# Altium schematic sheet HLK-AX3000-KIT-RJ45.SchDoc
size A3
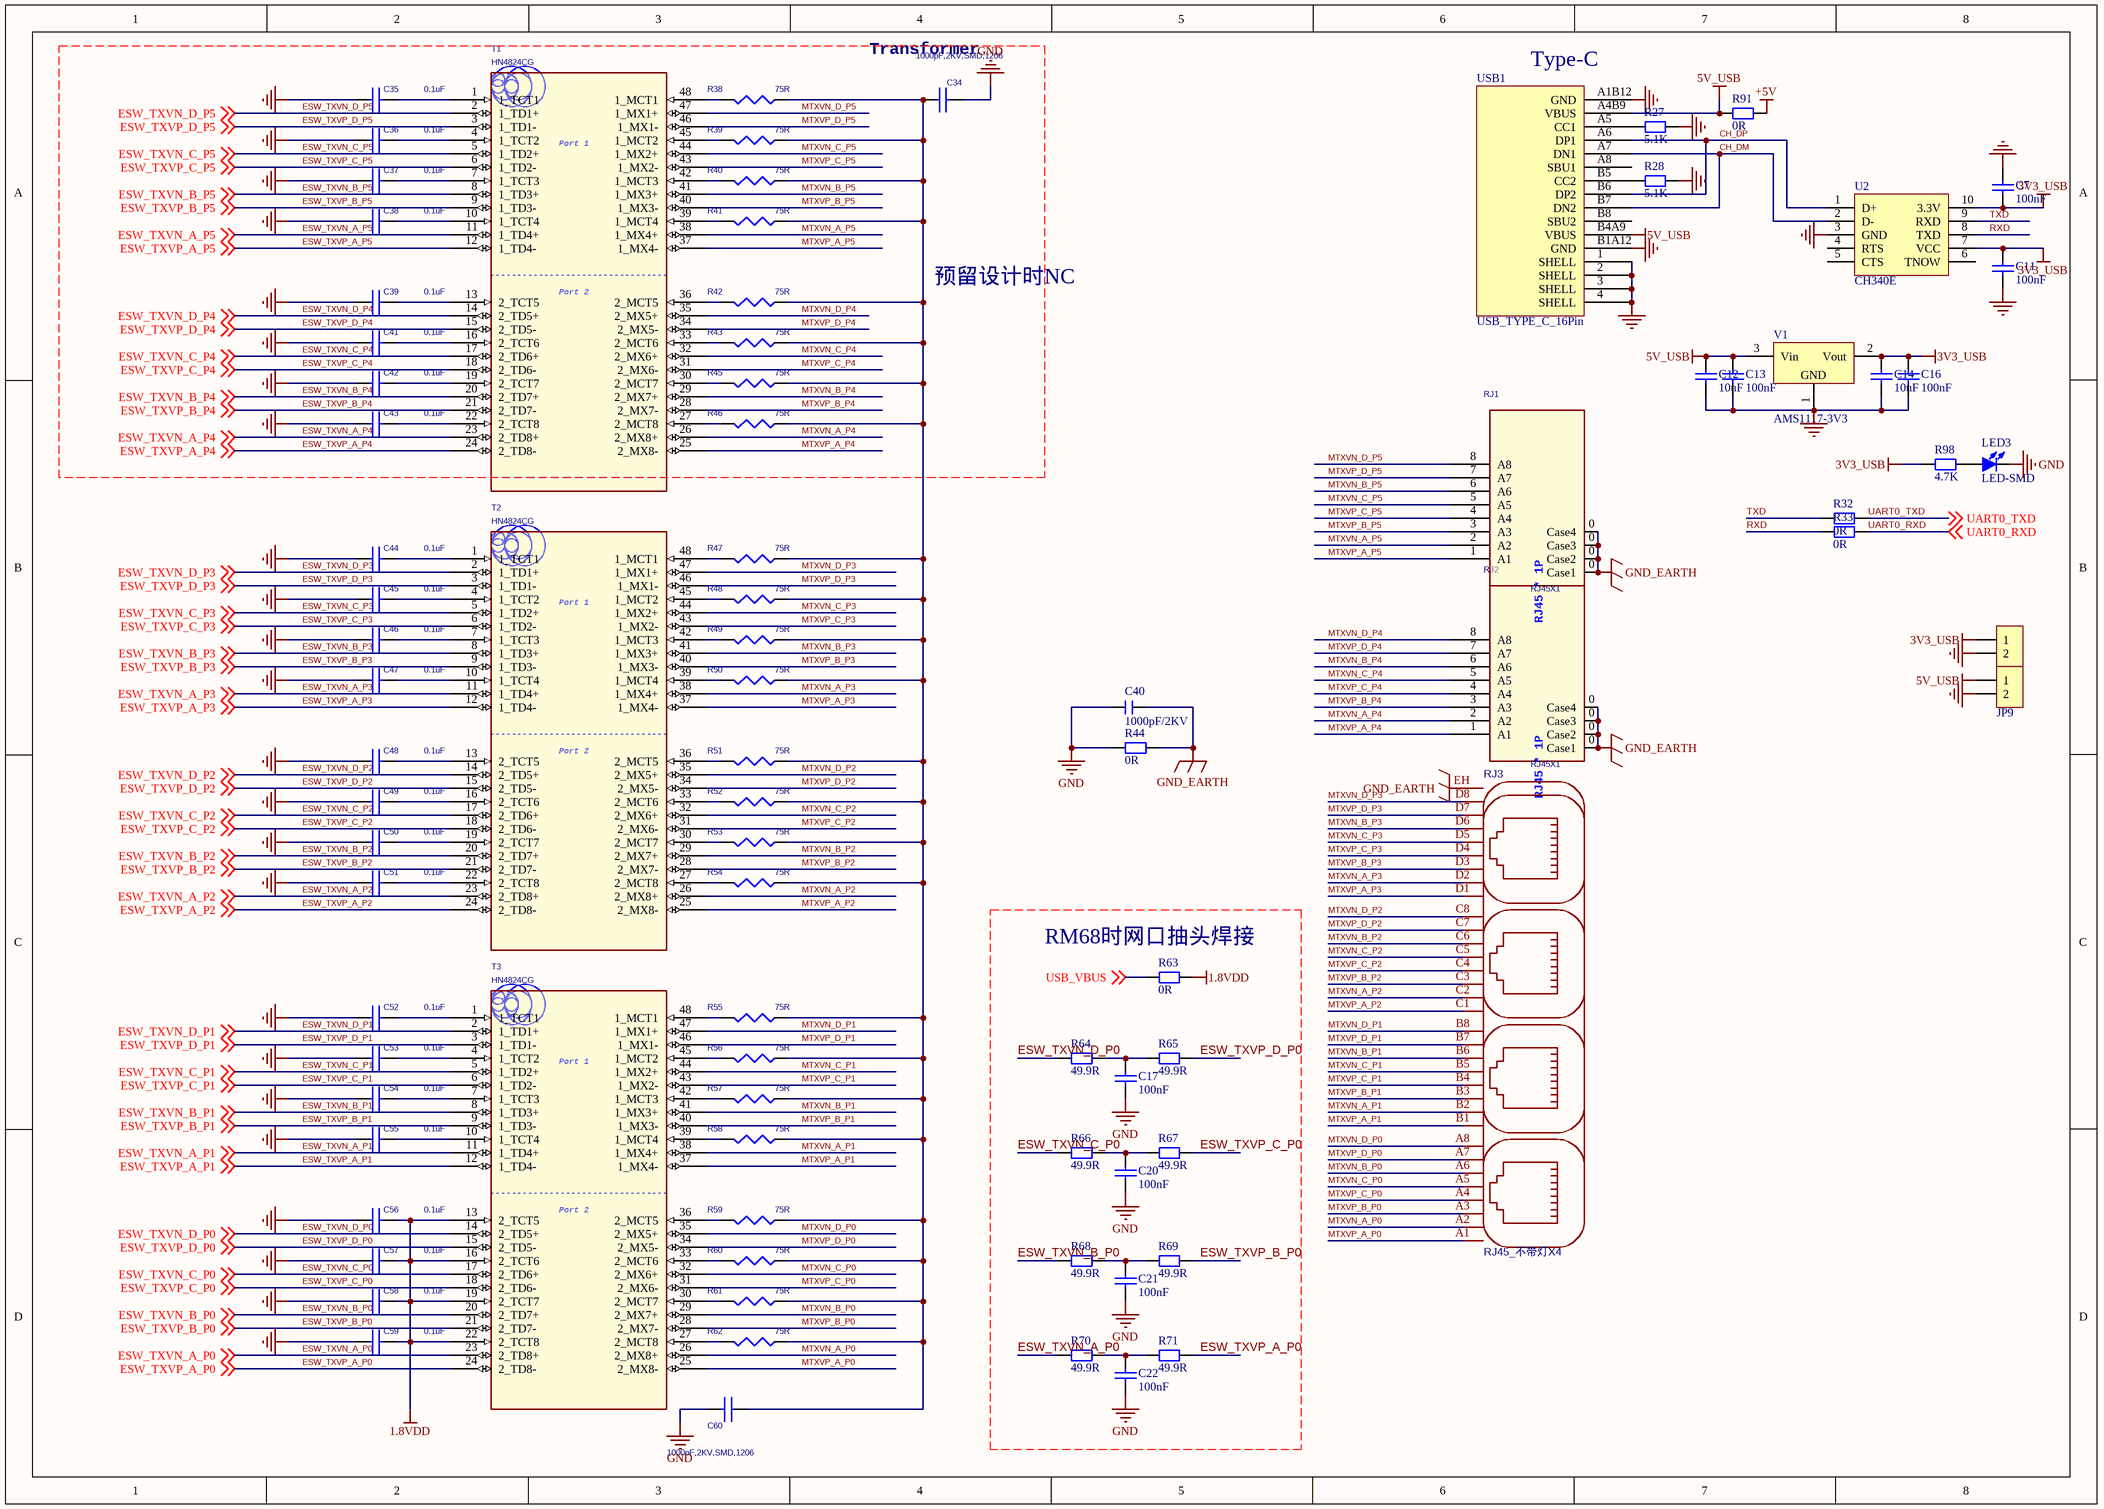
[diagram p0: HLK-AX3000-KIT-RJ45.SchDoc]

## Parts
C7  100nF  [C 0402_L]
C11  100nF  [C 0402_L]
C12  10uF  [C 0603_L]
C13  100nF  [C 0402_L]
C14  10uF  [C 0603_L]
C16  100nF  [C 0402_L]
C17  100nF  [C 0402_L]
C20  100nF  [C 0402_L]
C21  100nF  [C 0402_L]
C22  100nF  [C 0402_L]
C34  1000pF,2KV,SMD,1206  [C 1206_L]
C35  0.1uF  [C 0402_L]
C36  0.1uF  [C 0402_L]
C37  0.1uF  [C 0402_L]
C38  0.1uF  [C 0402_L]
C39  0.1uF  [C 0402_L]
C40  1000pF/2KV  [C 1206_L]
C41  0.1uF  [C 0402_L]
C42  0.1uF  [C 0402_L]
C43  0.1uF  [C 0402_L]
C44  0.1uF  [C 0402_L]
C45  0.1uF  [C 0402_L]
C46  0.1uF  [C 0402_L]
C47  0.1uF  [C 0402_L]
C48  0.1uF  [C 0402_L]
C49  0.1uF  [C 0402_L]
C50  0.1uF  [C 0402_L]
C51  0.1uF  [C 0402_L]
C52  0.1uF  [C 0402_L]
C53  0.1uF  [C 0402_L]
C54  0.1uF  [C 0402_L]
C55  0.1uF  [C 0402_L]
C56  0.1uF  [C 0402_L]
C57  0.1uF  [C 0402_L]
C58  0.1uF  [C 0402_L]
C59  0.1uF  [C 0402_L]
C60  1000pF,2KV,SMD,1206  [C 1206_L]
JP8  HDR-1X2  [HDR2.54-LI-2P]  (value not drawn)
JP9  HDR-1X2  [HDR2.54-LI-2P]  (value not drawn)
LED3  LED-SMD  [LED 0603G-L]
R27  5.1K  [R 0402_L]
R28  5.1K  [R 0402_L]
R32  0R  [R 0402_L]
R33  0R  [R 0402_L]
R38  75R  [R 0402_L]
R39  75R  [R 0402_L]
R40  75R  [R 0402_L]
R41  75R  [R 0402_L]
R42  75R  [R 0402_L]
R43  75R  [R 0402_L]
R44  0R  [R 1206_L]
R45  75R  [R 0402_L]
R46  75R  [R 0402_L]
R47  75R  [R 0402_L]
R48  75R  [R 0402_L]
R49  75R  [R 0402_L]
R50  75R  [R 0402_L]
R51  75R  [R 0402_L]
R52  75R  [R 0402_L]
R53  75R  [R 0402_L]
R54  75R  [R 0402_L]
R55  75R  [R 0402_L]
R56  75R  [R 0402_L]
R57  75R  [R 0402_L]
R58  75R  [R 0402_L]
R59  75R  [R 0402_L]
R60  75R  [R 0402_L]
R61  75R  [R 0402_L]
R62  75R  [R 0402_L]
R63  0R  [R 0402_L]
R64  49.9R  [R 0402_L]
R65  49.9R  [R 0402_L]
R66  49.9R  [R 0402_L]
R67  49.9R  [R 0402_L]
R68  49.9R  [R 0402_L]
R69  49.9R  [R 0402_L]
R70  49.9R  [R 0402_L]
R71  49.9R  [R 0402_L]
R91  0R  [R 0603_L]
R98  4.7K  [R 0402_L]
RJ1  RJ45X1  [RJ45_网口不带灯X1]
RJ2  RJ45X1  [RJ45_网口不带灯X1]
RJ3  RJ45_不带灯X4  [RJ45_网口不带灯X4]
T1  HN4824CG  [TRANSFORMER/48P/SMD/GS5014LF]
T2  HN4824CG  [TRANSFORMER/48P/SMD/GS5014LF]
T3  HN4824CG  [TRANSFORMER/48P/SMD/GS5014LF]
U2  CH340E  [MSOP10_L]
USB1  USB_TYPE_C_16Pin  [USB-C-16PIN-1]
V1  AMS1117-3V3  [SOT223_L]

## Nets
1.8VDD: C56.2 C57.2 C58.2 C59.2 R63.1 T3.13(2_TCT5) T3.16(2_TCT6) T3.19(2_TCT7) T3.22(2_TCT8)
3V3_USB: C7.2 C11.2 C14.2 C16.1 JP8.1 R98.2 U2.7(VCC) U2.10(3.3V) V1.2(Vout)
5V_USB: C12.2 C13.1 JP9.1 R91.1 USB1.A4B9(VBUS) USB1.B4A9(VBUS) V1.3(Vin)
+5V: R91.2
GND: C7.1 C11.1 C12.1 C13.2 C14.1 C16.2 C17.2 C20.2 C21.2 C22.2 C34.2 C35.1 C36.1 C37.1 C38.1 C39.1 C40.1 C41.1 C42.1 C43.1 C44.1 C45.1 C46.1 C47.1 C48.1 C49.1 C50.1 C51.1 C52.1 C53.1 C54.1 C55.1 C56.1 C57.1 C58.1 C59.1 C60.2 JP8.2 JP9.2 LED3.2(K) R27.1 R28.1 R44.1 U2.3(GND) USB1.1(SHELL) USB1.2(SHELL) USB1.3(SHELL) USB1.4(SHELL) USB1.A1B12(GND) USB1.B1A12(GND) V1.1(GND)
GND_EARTH: C40.2 R44.2 RJ1.0(Case1) RJ2.0(Case1) RJ3.EH
CH_DM: U2.2(D-) USB1.A7(DN1) USB1.B7(DN2)
CH_DP: U2.1(D+) USB1.A6(DP1) USB1.B6(DP2)
ESW_TXVN_A_P0: R70.1 T3.23(2_TD8+) ; off-sheet ESW_TXVN_A_P0
ESW_TXVN_A_P1: T3.11(1_TD4+) ; off-sheet ESW_TXVN_A_P1
ESW_TXVN_A_P2: T2.23(2_TD8+) ; off-sheet ESW_TXVN_A_P2
ESW_TXVN_A_P3: T2.11(1_TD4+) ; off-sheet ESW_TXVN_A_P3
ESW_TXVN_A_P4: T1.23(2_TD8+) ; off-sheet ESW_TXVN_A_P4
ESW_TXVN_A_P5: T1.11(1_TD4+) ; off-sheet ESW_TXVN_A_P5
ESW_TXVN_B_P0: R68.1 T3.20(2_TD7+) ; off-sheet ESW_TXVN_B_P0
ESW_TXVN_B_P1: T3.8(1_TD3+) ; off-sheet ESW_TXVN_B_P1
ESW_TXVN_B_P2: T2.20(2_TD7+) ; off-sheet ESW_TXVN_B_P2
ESW_TXVN_B_P3: T2.8(1_TD3+) ; off-sheet ESW_TXVN_B_P3
ESW_TXVN_B_P4: T1.20(2_TD7+) ; off-sheet ESW_TXVN_B_P4
ESW_TXVN_B_P5: T1.8(1_TD3+) ; off-sheet ESW_TXVN_B_P5
ESW_TXVN_C_P0: R66.1 T3.17(2_TD6+) ; off-sheet ESW_TXVN_C_P0
ESW_TXVN_C_P1: T3.5(1_TD2+) ; off-sheet ESW_TXVN_C_P1
ESW_TXVN_C_P2: T2.17(2_TD6+) ; off-sheet ESW_TXVN_C_P2
ESW_TXVN_C_P3: T2.5(1_TD2+) ; off-sheet ESW_TXVN_C_P3
ESW_TXVN_C_P4: T1.17(2_TD6+) ; off-sheet ESW_TXVN_C_P4
ESW_TXVN_C_P5: T1.5(1_TD2+) ; off-sheet ESW_TXVN_C_P5
ESW_TXVN_D_P0: R64.1 T3.14(2_TD5+) ; off-sheet ESW_TXVN_D_P0
ESW_TXVN_D_P1: T3.2(1_TD1+) ; off-sheet ESW_TXVN_D_P1
ESW_TXVN_D_P2: T2.14(2_TD5+) ; off-sheet ESW_TXVN_D_P2
ESW_TXVN_D_P3: T2.2(1_TD1+) ; off-sheet ESW_TXVN_D_P3
ESW_TXVN_D_P4: T1.14(2_TD5+) ; off-sheet ESW_TXVN_D_P4
ESW_TXVN_D_P5: T1.2(1_TD1+) ; off-sheet ESW_TXVN_D_P5
ESW_TXVP_A_P0: R71.2 T3.24(2_TD8-) ; off-sheet ESW_TXVP_A_P0
ESW_TXVP_A_P1: T3.12(1_TD4-) ; off-sheet ESW_TXVP_A_P1
ESW_TXVP_A_P2: T2.24(2_TD8-) ; off-sheet ESW_TXVP_A_P2
ESW_TXVP_A_P3: T2.12(1_TD4-) ; off-sheet ESW_TXVP_A_P3
ESW_TXVP_A_P4: T1.24(2_TD8-) ; off-sheet ESW_TXVP_A_P4
ESW_TXVP_A_P5: T1.12(1_TD4-) ; off-sheet ESW_TXVP_A_P5
ESW_TXVP_B_P0: R69.2 T3.21(2_TD7-) ; off-sheet ESW_TXVP_B_P0
ESW_TXVP_B_P1: T3.9(1_TD3-) ; off-sheet ESW_TXVP_B_P1
ESW_TXVP_B_P2: T2.21(2_TD7-) ; off-sheet ESW_TXVP_B_P2
ESW_TXVP_B_P3: T2.9(1_TD3-) ; off-sheet ESW_TXVP_B_P3
ESW_TXVP_B_P4: T1.21(2_TD7-) ; off-sheet ESW_TXVP_B_P4
ESW_TXVP_B_P5: T1.9(1_TD3-) ; off-sheet ESW_TXVP_B_P5
ESW_TXVP_C_P0: R67.2 T3.18(2_TD6-) ; off-sheet ESW_TXVP_C_P0
ESW_TXVP_C_P1: T3.6(1_TD2-) ; off-sheet ESW_TXVP_C_P1
ESW_TXVP_C_P2: T2.18(2_TD6-) ; off-sheet ESW_TXVP_C_P2
ESW_TXVP_C_P3: T2.6(1_TD2-) ; off-sheet ESW_TXVP_C_P3
ESW_TXVP_C_P4: T1.18(2_TD6-) ; off-sheet ESW_TXVP_C_P4
ESW_TXVP_C_P5: T1.6(1_TD2-) ; off-sheet ESW_TXVP_C_P5
ESW_TXVP_D_P0: R65.2 T3.15(2_TD5-) ; off-sheet ESW_TXVP_D_P0
ESW_TXVP_D_P1: T3.3(1_TD1-) ; off-sheet ESW_TXVP_D_P1
ESW_TXVP_D_P2: T2.15(2_TD5-) ; off-sheet ESW_TXVP_D_P2
ESW_TXVP_D_P3: T2.3(1_TD1-) ; off-sheet ESW_TXVP_D_P3
ESW_TXVP_D_P4: T1.15(2_TD5-) ; off-sheet ESW_TXVP_D_P4
ESW_TXVP_D_P5: T1.3(1_TD1-) ; off-sheet ESW_TXVP_D_P5
MTXVN_A_P0: RJ3.A2 T3.26(2_MX8+)
MTXVN_A_P1: RJ3.B2 T3.38(1_MX4+)
MTXVN_A_P2: RJ3.C2 T2.26(2_MX8+)
MTXVN_A_P3: RJ3.D2 T2.38(1_MX4+)
MTXVN_A_P4: RJ2.2(A2) T1.26(2_MX8+)
MTXVN_A_P5: RJ1.2(A2) T1.38(1_MX4+)
MTXVN_B_P0: RJ3.A6 T3.29(2_MX7+)
MTXVN_B_P1: RJ3.B6 T3.41(1_MX3+)
MTXVN_B_P2: RJ3.C6 T2.29(2_MX7+)
MTXVN_B_P3: RJ3.D6 T2.41(1_MX3+)
MTXVN_B_P4: RJ2.6(A6) T1.29(2_MX7+)
MTXVN_B_P5: RJ1.6(A6) T1.41(1_MX3+)
MTXVN_C_P0: RJ3.A5 T3.32(2_MX6+)
MTXVN_C_P1: RJ3.B5 T3.44(1_MX2+)
MTXVN_C_P2: RJ3.C5 T2.32(2_MX6+)
MTXVN_C_P3: RJ3.D5 T2.44(1_MX2+)
MTXVN_C_P4: RJ2.5(A5) T1.32(2_MX6+)
MTXVN_C_P5: RJ1.5(A5) T1.44(1_MX2+)
MTXVN_D_P0: RJ3.A8 T3.35(2_MX5+)
MTXVN_D_P1: RJ3.B8 T3.47(1_MX1+)
MTXVN_D_P2: RJ3.C8 T2.35(2_MX5+)
MTXVN_D_P3: RJ3.D8 T2.47(1_MX1+)
MTXVN_D_P4: RJ2.8(A8) T1.35(2_MX5+)
MTXVN_D_P5: RJ1.8(A8) T1.47(1_MX1+)
MTXVP_A_P0: RJ3.A1 T3.25(2_MX8-)
MTXVP_A_P1: RJ3.B1 T3.37(1_MX4-)
MTXVP_A_P2: RJ3.C1 T2.25(2_MX8-)
MTXVP_A_P3: RJ3.D1 T2.37(1_MX4-)
MTXVP_A_P4: RJ2.1(A1) T1.25(2_MX8-)
MTXVP_A_P5: RJ1.1(A1) T1.37(1_MX4-)
MTXVP_B_P0: RJ3.A3 T3.28(2_MX7-)
MTXVP_B_P1: RJ3.B3 T3.40(1_MX3-)
MTXVP_B_P2: RJ3.C3 T2.28(2_MX7-)
MTXVP_B_P3: RJ3.D3 T2.40(1_MX3-)
MTXVP_B_P4: RJ2.3(A3) T1.28(2_MX7-)
MTXVP_B_P5: RJ1.3(A3) T1.40(1_MX3-)
MTXVP_C_P0: RJ3.A4 T3.31(2_MX6-)
MTXVP_C_P1: RJ3.B4 T3.43(1_MX2-)
MTXVP_C_P2: RJ3.C4 T2.31(2_MX6-)
MTXVP_C_P3: RJ3.D4 T2.43(1_MX2-)
MTXVP_C_P4: RJ2.4(A4) T1.31(2_MX6-)
MTXVP_C_P5: RJ1.4(A4) T1.43(1_MX2-)
MTXVP_D_P0: RJ3.A7 T3.34(2_MX5-)
MTXVP_D_P1: RJ3.B7 T3.46(1_MX1-)
MTXVP_D_P2: RJ3.C7 T2.34(2_MX5-)
MTXVP_D_P3: RJ3.D7 T2.46(1_MX1-)
MTXVP_D_P4: RJ2.7(A7) T1.34(2_MX5-)
MTXVP_D_P5: RJ1.7(A7) T1.46(1_MX1-)
RXD: R33.2 U2.8(TXD)
TXD: R32.2 U2.9(RXD)
UART0_RXD: R33.1 ; off-sheet UART0_RXD
UART0_TXD: R32.1 ; off-sheet UART0_TXD
USB_VBUS: R63.2 ; off-sheet USB_VBUS
NetC17_1: C17.1 R64.2 R65.1
NetC20_1: C20.1 R66.2 R67.1
NetC21_1: C21.1 R68.2 R69.1
NetC22_1: C22.1 R70.2 R71.1
NetC34_1: C34.1 C60.1 R38.1 R39.1 R40.1 R41.1 R42.1 R43.1 R45.1 R46.1 R47.1 R48.1 R49.1 R50.1 R51.1 R52.1 R53.1 R54.1 R55.1 R56.1 R57.1 R58.1 R59.1 R60.1 R61.1 R62.1
NetC35_2: C35.2 T1.1(1_TCT1)
NetC36_2: C36.2 T1.4(1_TCT2)
NetC37_2: C37.2 T1.7(1_TCT3)
NetC38_2: C38.2 T1.10(1_TCT4)
NetC39_2: C39.2 T1.13(2_TCT5)
NetC41_2: C41.2 T1.16(2_TCT6)
NetC42_2: C42.2 T1.19(2_TCT7)
NetC43_2: C43.2 T1.22(2_TCT8)
NetC44_2: C44.2 T2.1(1_TCT1)
NetC45_2: C45.2 T2.4(1_TCT2)
NetC46_2: C46.2 T2.7(1_TCT3)
NetC47_2: C47.2 T2.10(1_TCT4)
NetC48_2: C48.2 T2.13(2_TCT5)
NetC49_2: C49.2 T2.16(2_TCT6)
NetC50_2: C50.2 T2.19(2_TCT7)
NetC51_2: C51.2 T2.22(2_TCT8)
NetC52_2: C52.2 T3.1(1_TCT1)
NetC53_2: C53.2 T3.4(1_TCT2)
NetC54_2: C54.2 T3.7(1_TCT3)
NetC55_2: C55.2 T3.10(1_TCT4)
NetLED3_1: LED3.1(A) R98.1
NetR27_2: R27.2 USB1.A5(CC1)
NetR28_2: R28.2 USB1.B5(CC2)
NetR38_2: R38.2 T1.48(1_MCT1)
NetR39_2: R39.2 T1.45(1_MCT2)
NetR40_2: R40.2 T1.42(1_MCT3)
NetR41_2: R41.2 T1.39(1_MCT4)
NetR42_2: R42.2 T1.36(2_MCT5)
NetR43_2: R43.2 T1.33(2_MCT6)
NetR45_2: R45.2 T1.30(2_MCT7)
NetR46_2: R46.2 T1.27(2_MCT8)
NetR47_2: R47.2 T2.48(1_MCT1)
NetR48_2: R48.2 T2.45(1_MCT2)
NetR49_2: R49.2 T2.42(1_MCT3)
NetR50_2: R50.2 T2.39(1_MCT4)
NetR51_2: R51.2 T2.36(2_MCT5)
NetR52_2: R52.2 T2.33(2_MCT6)
NetR53_2: R53.2 T2.30(2_MCT7)
NetR54_2: R54.2 T2.27(2_MCT8)
NetR55_2: R55.2 T3.48(1_MCT1)
NetR56_2: R56.2 T3.45(1_MCT2)
NetR57_2: R57.2 T3.42(1_MCT3)
NetR58_2: R58.2 T3.39(1_MCT4)
NetR59_2: R59.2 T3.36(2_MCT5)
NetR60_2: R60.2 T3.33(2_MCT6)
NetR61_2: R61.2 T3.30(2_MCT7)
NetR62_2: R62.2 T3.27(2_MCT8)

Not connected (* = marked no-connect by the designer): U2 4(RTS) 5(CTS) 6(TNOW); USB1 A8(SBU1) B8(SBU2)

## Notes on the sheet
- (near C34) Transformer
- (near USB1) Type-C
- 预留设计时NC
- (near R63) RM68时网口抽头焊接
- (in symbol RJ45X1_4) RJ45 * 1P
- (in symbol XMER 2P G2PM109N) Port 1; Port 2

## Library data of the parts
C7 C11 C13 C16 C17 C20-C22 = Cap: Capacitor; 物料名称: 贴片电容; 物料编码: 3.01.04.0056
C12 C14 = Cap: Capacitor; Manufacturer: Generic Components; Class: Passive; Value: 100pF; Published: 08/06/2000; Publisher: Altium Hobart Technology Centre; SubClass: Capacitor
C34 C60 = CAP NP_Dup1: Cap, HighVolt, SMD 1206, 2KV; Manufacturer: Arcotromics; Class: 0C-HighVolt; Key: 3162U-N14-V11-#409; BOM_Class: RJ45; HYP_Type: (C; By: Ralink; Price_USD: 0.02; Price: 0.66; Package_Type: 床杆; Package: DIP; Distributor: 窲瓣悔; Distributor_Name: 羘縈; Distributor_Name2: Alven; Distributor_Mobile: 0933-153488; Distributor_TEL: 02-2999-6599 #163; Distributor_FAX: 02-2999-6614
C35-C39 C41-C43 C48-C53 C56 C57 = 0.1UF/25V_+80%-20%_CC_S0603: Cap, MLCC, 0402, Y5V, 16V; Manufacturer: 地穝; Part Number: 100-110-03400; V1: 25V +80% -20%; P/N: 26-400-311104; Class: 0C-0402; Key: 3162U-N14-V11-#478; BOM_Class: RJ45; HYP_Type: (C; By: Ralink; Package: SMD; Distributor_FAX: 02-2917-3336~7; Distributor_TEL: 02-2917-3334; Distributor_Mobile: 0939-969-849; Distributor_Name: 糂╭; Distributor: 瓁穨; Package_Type: Reel
C40 = C: 无极性贴片电容; 版权归属: 源创客; BOM名称: 无极性贴片电容; 学习资源: www.ooocke.com
C44-C47 C54 C55 C58 C59 = 0.1UF/25V_+80%-20%_CC_S0603: Cap, MLCC, 0402, Y5V, 16V; Part Number: 100-110-03400; Manufacturer: 地穝; V1: 25V +80% -20%; P/N: 26-400-311104; By: Ralink; HYP_Type: (C; BOM_Class: RJ45; Key: 3162U-N14-V11-#478; Class: 0C-0402; Package: SMD; Package_Type: Reel; Distributor: 瓁穨; Distributor_Name: 糂╭; Distributor_Mobile: 0939-969-849; Distributor_TEL: 02-2917-3334; Distributor_FAX: 02-2917-3336~7
JP8 JP9 = Header 2: 2P接插件; 版权归属: 源创客; BOM名称: 2P接插件; 学习资源: www.ooocke.com
LED3 = LED-SMD: 贴片LED; 版权归属: 源创客; BOM名称: 贴片LED; 学习资源: www.ooocke.com
R27 R28 R32 R33 R44 R63-R71 R91 R98 = R: 贴片电阻; 版权归属: 源创客; BOM名称: 贴片电阻; 学习资源: www.ooocke.com
R38 R39 R42 R43 = R75_1%_S0603: Resistor, 0402, 5%; Manufacturer: 驾м; Part Number: 110-110-03300; V1: 1% 1/16W; P/N: 21-201-627501; SDTSourceLibName: C:\WINDOWS\TEMP\DEVICE1.LIB; HYP_Type: (R; BOM_Class: RJ45; By: Ralink; Key: 3162U-N14-V11-#345; Class: 1R-0402; Package: SMD; Distributor_FAX: 03-3245183 ,3247410; Distributor_TEL: 03-3246169 #2221; Distributor_Name2: Cherry Yang; Distributor_Name: 法睶骸; Distributor: 驾м; Price: 0.0099; Package_Type: Reel; Price_USD: 0.0003; Distributor_Mobile: NA
R40 R45 = R75_1%_S0603: Resistor, 0402, 5%; Manufacturer: 驾м; Part Number: 110-110-03300; V1: 1% 1/16W; P/N: 21-201-627501; SDTSourceLibName: C:\WINDOWS\TEMP\DEVICE1.LIB; By: Ralink; BOM_Class: RJ45; HYP_Type: (R; Key: 3162U-N14-V11-#345; Class: 1R-0402; Package: SMD; Distributor_FAX: 03-3245183 ,3247410; Distributor_TEL: 03-3246169 #2221; Distributor_Name2: Cherry Yang; Distributor_Name: 法睶骸; Distributor: 驾м; Package_Type: Reel; Price: 0.0099; Price_USD: 0.0003; Distributor_Mobile: NA
R41 R46 = R75_1%_S0603: Resistor, 0402, 5%; Part Number: 110-110-03300; Manufacturer: 驾м; V1: 1% 1/16W; P/N: 21-201-627501; SDTSourceLibName: C:\WINDOWS\TEMP\DEVICE1.LIB; Class: 1R-0402; Key: 3162U-N14-V11-#345; HYP_Type: (R; BOM_Class: RJ45; By: Ralink; Package: SMD; Distributor_Mobile: NA; Price_USD: 0.0003; Price: 0.0099; Package_Type: Reel; Distributor: 驾м; Distributor_Name: 法睶骸; Distributor_Name2: Cherry Yang; Distributor_TEL: 03-3246169 #2221; Distributor_FAX: 03-3245183 ,3247410
R47 R50 R53 R58-R60 R62 = R75_1%_S0603: Resistor, SMD 0402, 5%; Manufacturer: 驾м; Part Number: 110-110-03300; V1: 5% 1/4W; P/N: 21-201-627501; SDTSourceLibName: C:\WINDOWS\TEMP\SCH.LIB; By: Ralink; BOM_Class: RJ45; HYP_Type: (R; Key: 3162U-N14-V11-#345; Class: 1R-0402; Package: SMD; Distributor_FAX: 03-3245183 ,3247410; Distributor_TEL: 03-3246169 #2221; Distributor_Name2: Cherry Yang; Distributor_Name: 法睶骸; Distributor: 驾м; Package_Type: Reel; Distributor_Mobile: NA
R48 R49 R51 R52 R54-R57 R61 = R75_1%_S0603: Resistor, SMD 0402, 5%; Part Number: 110-110-03300; Manufacturer: 驾м; V1: 5% 1/4W; P/N: 21-201-627501; SDTSourceLibName: C:\WINDOWS\TEMP\SCH.LIB; Class: 1R-0402; Key: 3162U-N14-V11-#345; HYP_Type: (R; BOM_Class: RJ45; By: Ralink; Package: SMD; Distributor_Mobile: NA; Package_Type: Reel; Distributor: 驾м; Distributor_Name: 法睶骸; Distributor_Name2: Cherry Yang; Distributor_TEL: 03-3246169 #2221; Distributor_FAX: 03-3245183 ,3247410
RJ1 RJ2 = RJ45X1_4: Manufacturer: 救┹; Manufacturer's Part Number: PJ-A1-BXBH-FDNNN-1; Part Number: 214411*12311105
RJ3 = RJ45_不带灯X4: BOM_Manufacturer: CONNFLY; BOM_Manufacturer Part: DS1129-02-S80BP; subpart_no: 3; BOM_Supplier Part: C77852; BOM_Supplier: LCSC; image: http://image.lceda.cn/szlcsc/C77852.jpg; spicePre: R; spiceSymbolName: DS1129-02-S80BP
T1-T3 = XMER 2P G2PM109N
U2 = CH340E: 串口芯片
V1 = AMS1117: 三端稳压芯片; BOM名称: 稳压芯片; 版权归属: 源创客; 学习资源: www.ooocke.com